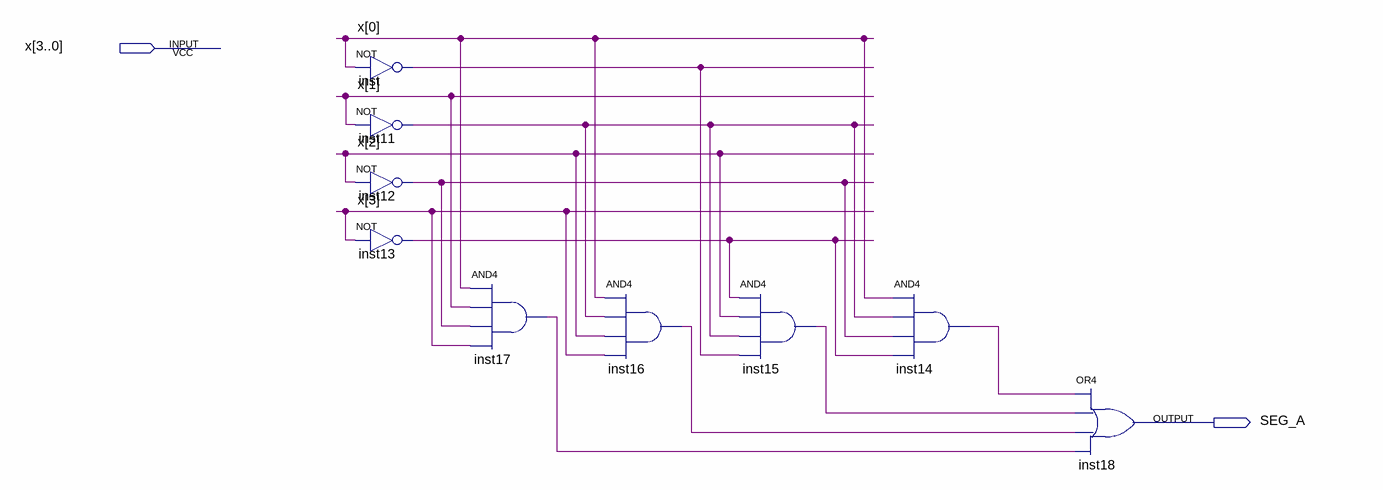
[diagram p0: schematic sheet]
// Quartus schematic SEG_A.bdf as structural Verilog: 9 symbols, 2 pins
module SEG_A (
  input  [3:0] x,
  output SEG_A
);

  wire inst11_out, inst12_out, inst13_out, inst14_out, inst15_out, inst16_out, inst17_out, inst_out;

  not inst (inst_out, x[0]);
  not inst11 (inst11_out, x[1]);
  not inst12 (inst12_out, x[2]);
  not inst13 (inst13_out, x[3]);
  and inst17 (inst17_out, x[0], x[1], inst12_out, x[3]);
  and inst16 (inst16_out, x[0], inst11_out, x[2], x[3]);
  and inst15 (inst15_out, inst13_out, x[2], inst11_out, inst_out);
  and inst14 (inst14_out, x[0], inst11_out, inst12_out, inst13_out);
  or inst18 (SEG_A, inst14_out, inst15_out, inst16_out, inst17_out);
endmodule
